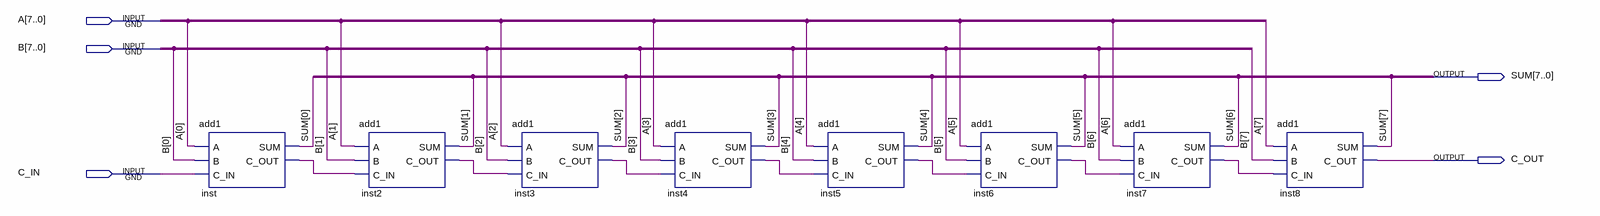
[diagram p0: schematic sheet]
// Quartus schematic add8.bdf as structural Verilog: 8 symbols, 5 pins
module add8 (
  input  [7:0] A,
  input  [7:0] B,
  input  C_IN,
  output [7:0] SUM,
  output C_OUT
);

  wire inst2_c_out, inst3_c_out, inst4_c_out, inst5_c_out, inst6_c_out, inst7_c_out, inst_c_out;

  add1 inst (.A(A[0]), .B(B[0]), .C_IN(C_IN), .SUM(SUM[0]), .C_OUT(inst_c_out));
  add1 inst2 (.A(A[1]), .B(B[1]), .C_IN(inst_c_out), .SUM(SUM[1]), .C_OUT(inst2_c_out));
  add1 inst3 (.A(A[2]), .B(B[2]), .C_IN(inst2_c_out), .SUM(SUM[2]), .C_OUT(inst3_c_out));
  add1 inst4 (.A(A[3]), .B(B[3]), .C_IN(inst3_c_out), .SUM(SUM[3]), .C_OUT(inst4_c_out));
  add1 inst5 (.A(A[4]), .B(B[4]), .C_IN(inst4_c_out), .SUM(SUM[4]), .C_OUT(inst5_c_out));
  add1 inst6 (.A(A[5]), .B(B[5]), .C_IN(inst5_c_out), .SUM(SUM[5]), .C_OUT(inst6_c_out));
  add1 inst7 (.A(A[6]), .B(B[6]), .C_IN(inst6_c_out), .SUM(SUM[6]), .C_OUT(inst7_c_out));
  add1 inst8 (.A(A[7]), .B(B[7]), .C_IN(inst7_c_out), .SUM(SUM[7]), .C_OUT(C_OUT));
endmodule
